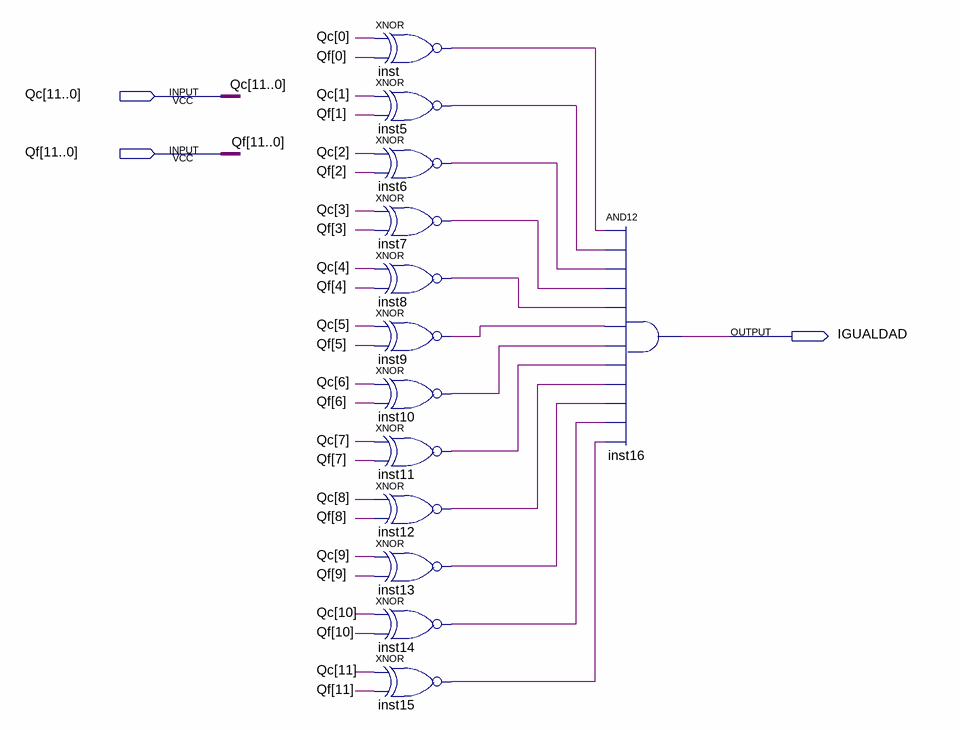
[diagram p0: schematic sheet]
// Quartus schematic comparador_igualdad.bdf as structural Verilog: 13 symbols, 3 pins
module comparador_igualdad (
  input  [11:0] Qc,
  input  [11:0] Qf,
  output IGUALDAD
);

  wire inst5_out, inst6_out, inst7_out, inst8_out, inst9_out, inst10_out, inst11_out, inst12_out, inst13_out,
       inst14_out, inst15_out, inst_out;

  xnor inst (inst_out, Qc[0], Qf[0]);
  xnor inst5 (inst5_out, Qc[1], Qf[1]);
  xnor inst6 (inst6_out, Qc[2], Qf[2]);
  xnor inst7 (inst7_out, Qc[3], Qf[3]);
  xnor inst8 (inst8_out, Qc[4], Qf[4]);
  xnor inst9 (inst9_out, Qc[5], Qf[5]);
  xnor inst10 (inst10_out, Qc[6], Qf[6]);
  xnor inst11 (inst11_out, Qc[7], Qf[7]);
  xnor inst12 (inst12_out, Qc[8], Qf[8]);
  xnor inst13 (inst13_out, Qc[9], Qf[9]);
  xnor inst14 (inst14_out, Qc[10], Qf[10]);
  xnor inst15 (inst15_out, Qc[11], Qf[11]);
  and inst16 (IGUALDAD, inst_out, inst5_out, inst6_out, inst7_out, inst8_out, inst9_out, inst10_out, inst11_out, inst12_out, inst13_out, inst14_out, inst15_out);
endmodule
